# EAGLE schematic bias (EAGLE 8.3.2)
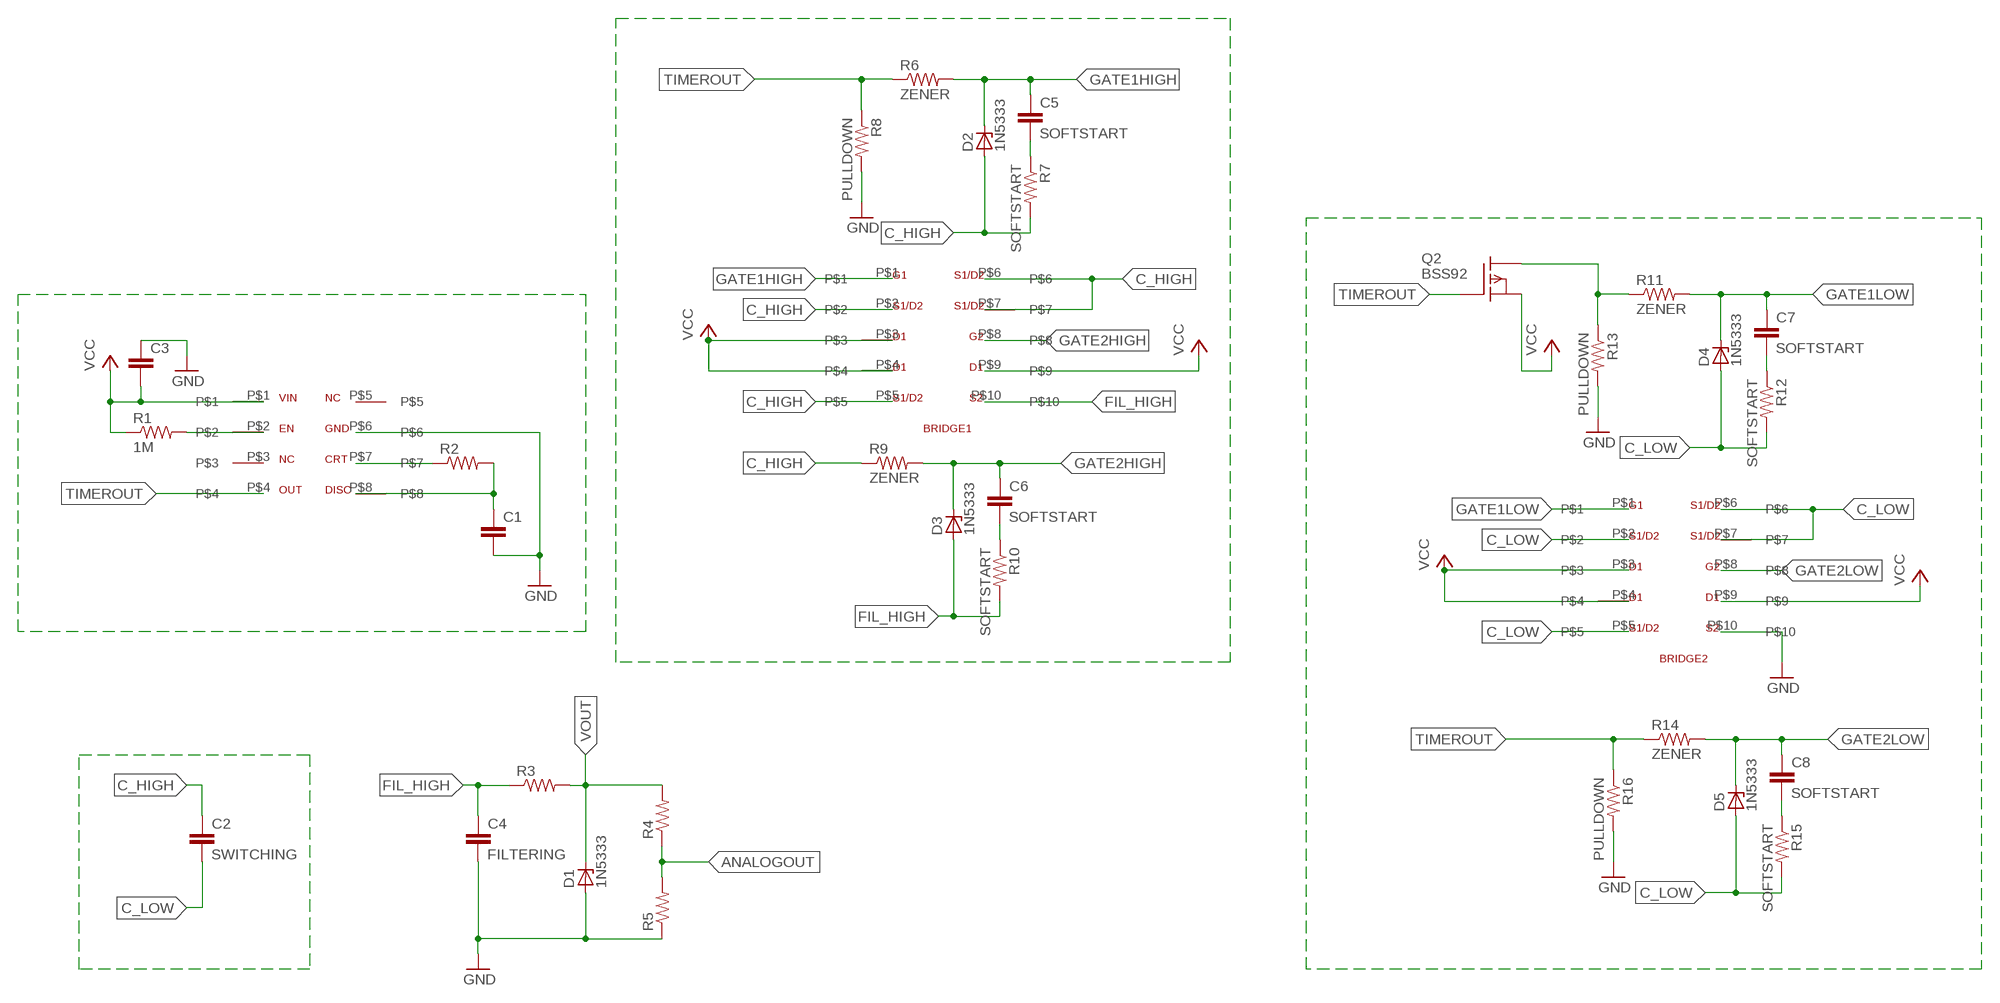
[diagram p0: schematic, sheet 1]

## Parts
BRIDGE1  FDMD85100  [HALFBRIDGE]
BRIDGE2  FDMD85100  [HALFBRIDGE]
C1  CC1206  [C1206]
C2  SWITCHING  CC1206  [C1206]
C3  CC1206  [C1206]
C4  FILTERING  CC1206  [C1206]
C5  SOFTSTART  CC1206  [C1206]
C6  SOFTSTART  CC1206  [C1206]
C7  SOFTSTART  CC1206  [C1206]
C8  SOFTSTART  CC1206  [C1206]
D1  1N5333  [C1702-15]
D2  1N5333  [C1702-15]
D3  1N5333  [C1702-15]
D4  1N5333  [C1702-15]
D5  1N5333  [C1702-15]
Q2  BSS92  [TO92]
R1  1M  R-US_R1210  [R1210]
R2  R-US_R1210  [R1210]
R3  R-US_R1210  [R1210]
R4  R-US_R1210  [R1210]
R5  R-US_R1210  [R1210]
R6  ZENER  R-US_R1210  [R1210]
R7  SOFTSTART  R-US_R1210  [R1210]
R8  PULLDOWN  R-US_R1210  [R1210]
R9  ZENER  R-US_R1210  [R1210]
R10  SOFTSTART  R-US_R1210  [R1210]
R11  ZENER  R-US_R1210  [R1210]
R12  SOFTSTART  R-US_R1210  [R1210]
R13  PULLDOWN  R-US_R1210  [R1210]
R14  ZENER  R-US_R1210  [R1210]
R15  SOFTSTART  R-US_R1210  [R1210]
R16  PULLDOWN  R-US_R1210  [R1210]
U$1  BD9555FVM-C  [MSOP8]

## Nets
ANALOGOUT: R4.1 R5.2
C_HIGH: BRIDGE1.P$2 BRIDGE1.P$5 BRIDGE1.P$6 BRIDGE1.P$7 C2.1 D2.A R7.2 R9.1
C_LOW: BRIDGE2.P$2 BRIDGE2.P$5 BRIDGE2.P$6 BRIDGE2.P$7 C2.2 D4.A D5.A R12.2 R15.2
FIL_HIGH: BRIDGE1.P$10 C4.1 D3.A R3.1 R10.2
GATE1HIGH: BRIDGE1.P$1 C5.1 D2.C R6.2
GATE1LOW: BRIDGE2.P$1 C7.1 D4.C R11.2
GATE2HIGH: BRIDGE1.P$8 C6.1 D3.C R9.2
GATE2LOW: BRIDGE2.P$8 C8.1 D5.C R14.2
GND: BRIDGE2.P$10 C1.2 C3.1 C4.2 D1.A R5.1 R8.2 R13.2 R16.2 U$1.P$6
N$1: R1.2 U$1.P$2
N$2: R2.1 U$1.P$7
N$3: C1.1 R2.2 U$1.P$8
N$6: C7.2 R12.1
N$7: C6.2 R10.1
N$9: C5.2 R7.1
N$10: C8.2 R15.1
N$11: Q2.1(G)
TIMEROUT: Q2.2(D) R6.1 R8.1 R11.1 R13.1 R14.1 R16.1 U$1.P$4
VCC: BRIDGE1.P$3 BRIDGE1.P$4 BRIDGE1.P$9 BRIDGE2.P$3 BRIDGE2.P$4 BRIDGE2.P$9 C3.2 Q2.3(S) R1.1 U$1.P$1
VOUT: D1.C R3.2 R4.2
Unconnected: U$1.P$3 U$1.P$5

## Library data of the parts
BRIDGE1 BRIDGE2 = parts:FDMD85100: Fairchild FDMD85100 Dual N Channel MOSFET
C1-C8 = eagle-ltspice:C: CAPACITOR, European symbol; SPICEMODEL: NONE; SPICEPREFIX: C
D1-D5 = diode:1N5333: Z DIODE 3.3 V, 5W, 5 percent (Motorola)
Q2 = transistor-fet:BSS92: P-Channel Enhancement MOSFET -200V; -0,15A; 11Ohm
R1-R16 = adafruit:R-US_: RESISTOR, American symbol
U$1 = parts:BD9555FVM-C: ROHM timer IC